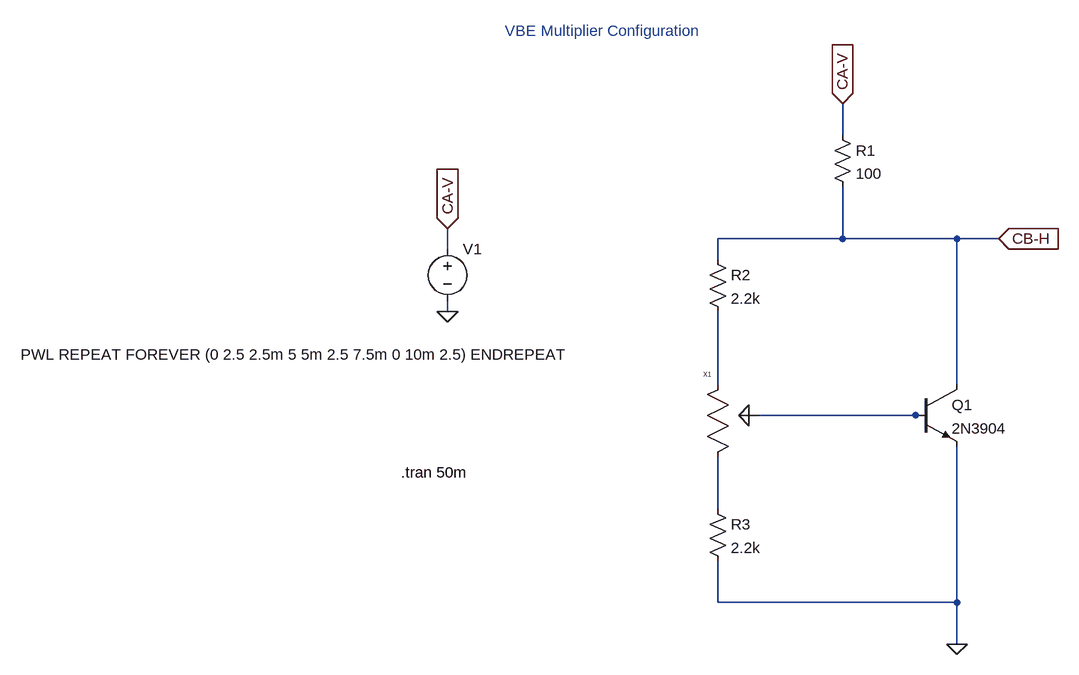
[diagram p0: schematic vbe_multiplier_config_ltspice.asc]
vbe_multiplier_config_ltspice.asc, the LTspice schematic file:
Version 4
SHEET 1 880 680
WIRE 416 -240 416 -288
WIRE 416 -80 416 -160
WIRE 416 -80 224 -80
WIRE 592 -80 416 -80
WIRE 656 -80 592 -80
WIRE -192 -64 -192 -96
WIRE 224 -48 224 -80
WIRE -192 32 -192 16
WIRE 224 144 224 32
WIRE 592 144 592 -80
WIRE 528 192 288 192
WIRE 544 192 528 192
WIRE 224 336 224 256
WIRE 224 480 224 416
WIRE 592 480 592 240
WIRE 592 480 224 480
WIRE 592 544 592 480
FLAG 416 -288 CA-V
IOPIN 416 -288 In
FLAG 656 -80 CB-H
IOPIN 656 -80 In
FLAG -192 32 0
FLAG -192 -96 CA-V
IOPIN -192 -96 In
FLAG 592 544 0
SYMBOL res 400 -256 R0
SYMATTR InstName R1
SYMATTR Value 100
SYMBOL voltage -192 -80 R0
WINDOW 3 -657 178 Left 2
WINDOW 123 0 0 Left 0
WINDOW 39 0 0 Left 0
SYMATTR Value PWL REPEAT FOREVER (0 2.5 2.5m 5 5m 2.5 7.5m 0 10m 2.5) ENDREPEAT
SYMATTR InstName V1
SYMBOL npn 528 144 R0
SYMATTR InstName Q1
SYMATTR Value 2N3904
SYMBOL res 208 -64 R0
SYMATTR InstName R2
SYMATTR Value 2.2k
SYMBOL res 208 320 R0
SYMATTR InstName R3
SYMATTR Value 2.2k
SYMBOL potentiometer 240 160 M0
SYMATTR InstName X1
SYMATTR SpiceLine R=5k, Val=50
TEXT -264 280 Left 2 !.tran 50m
TEXT -104 -400 Left 2 ;VBE Multiplier Configuration

The netlist it stands for:
* vbe_multiplier_config_ltspice.asc
R1 CA-V CB-H 100
V1 CA-V 0 PWL REPEAT FOREVER (0 2.5 2.5m 5 5m 2.5 7.5m 0 10m 2.5) ENDREPEAT
Q1 CB-H N002 0 0 2N3904
R2 CB-H N001 2.2k
R3 N003 0 2.2k
XX1 N001 N002 N003 potentiometer R=5k, Val=50  ; pins 1 2 3
.model NPN NPN
.model PNP PNP
.lib standard.bjt
.tran 50m
* VBE Multiplier Configuration
.backanno
.end